# EAGLE design 0129_ultrasound (EAGLE 9.6.2)
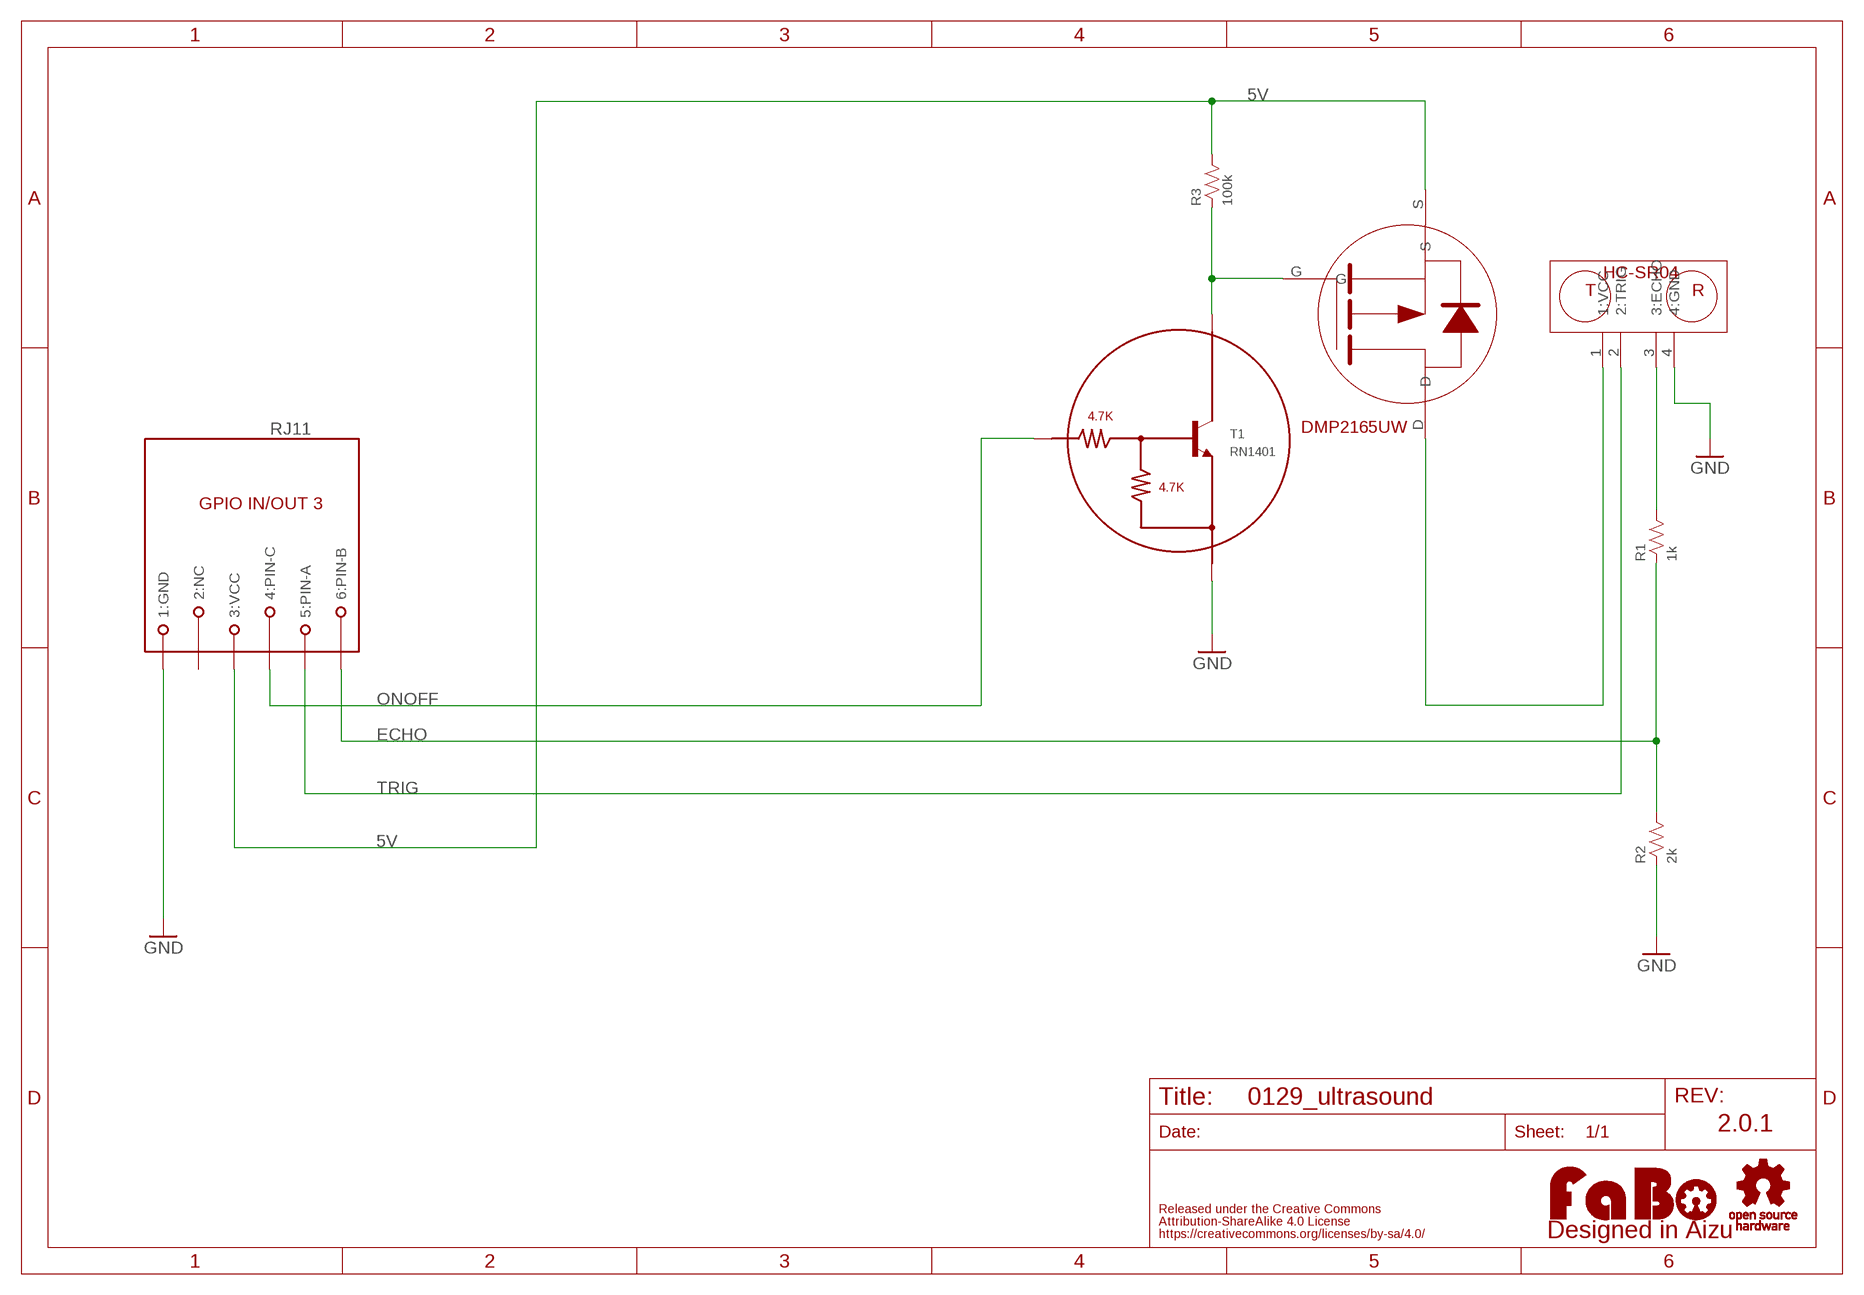
[diagram p0: schematic, sheet 1]

## Parts
LOGO1  LOGO_FABO-M_BOTTOM  [LOGO_FABO_M_BOTTOM]
PFET  DMP2165UW  [DMP2165_SOT323]
R1  1k  RESISTOR-0603-NARROW  [0603-NARROW]
R2  2k  RESISTOR-0603-NARROW  [0603-NARROW]
R3  100k  RESISTOR-0603-NARROW  [0603-NARROW]
RJ11  MODULAR-JACK-6P-RJ11_GPIO3  [7002-6PXC-X]
T1  RN1401  [SC-59]
U$3  LOGO_OSHW-M_BOTTOM  [LOGO_OSHW_M_BOTTOM]
U$5  HC-SR04  [HC-SR04]

## Nets
5V: PFET.S R3.2 RJ11.3(3:VCC)
ECHO: R1.1 R2.2 RJ11.6(6:PIN-B)
GND: R2.1 RJ11.1(1:GND) T1.E U$5.4(4:GND)
N$8: R1.2 U$5.3(3:ECHO)
N$9: PFET.D U$5.1(1:VCC)
ONOFF: RJ11.4(4:PIN-C) T1.B
POWERONOFF: PFET.G R3.1 T1.C
TRIG: RJ11.5(5:PIN-A) U$5.2(2:TRIG)
Unconnected: RJ11.2(2:NC)

## Notes on the sheet
- 2.0.1

## Library data of the parts
LOGO1 = component:LOGO_FABO
PFET = FaBo-Mosfet:DMP2165UW
R1-R3 = FaBo-Resistors:RESISTOR: RESISTOR
RJ11 = FaBo-Connetor:MODULAR-JACK-6P-RJ11_GPIO3
T1 = FaBo-Transistor:RN1401
U$3 = component:LOGO_OSHW
U$5 = FaBo-Sensor:HC-SR04

## Board
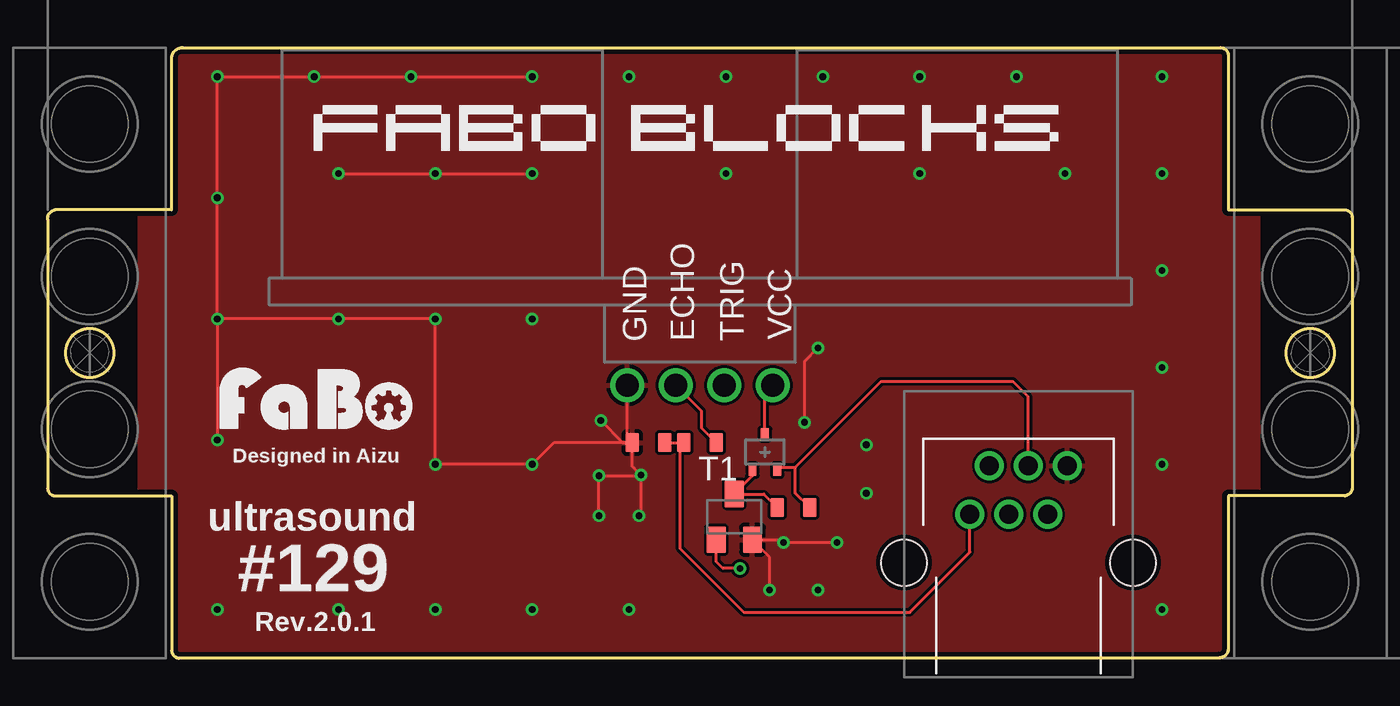
[diagram p1: board, top side]
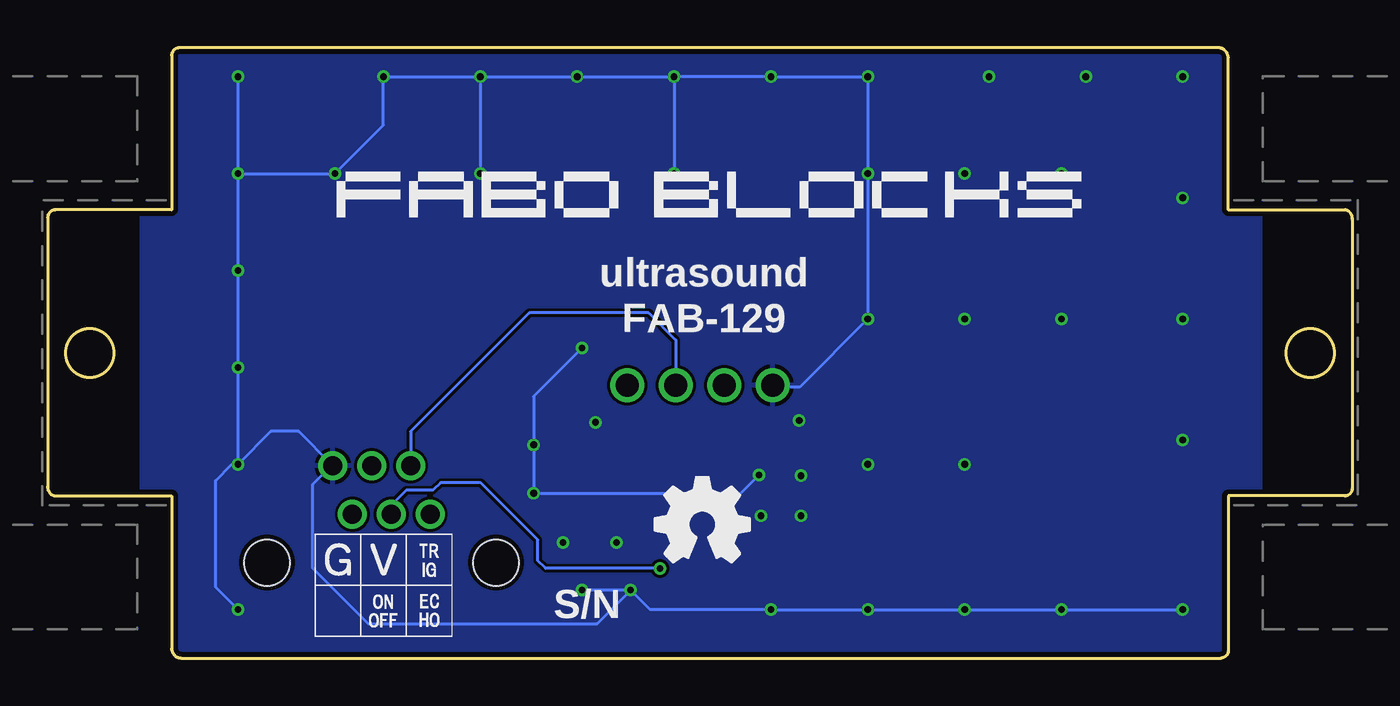
[diagram p2: board, bottom side, seen from below]

Size 68.41 x 32 mm. Coordinates in mm from the lower left corner, seen from the top.
Outline: 7.1,32 61.5,32 arc-90 61.9,31.6 61.9,23.5 68,23.5 arc-90 68.4,23.1 68.4,9 arc-90 68,8.5 61.9,8.5 61.9,0.5 arc-90 61.4,0 6.9,0 arc-90 6.5,0.4 6.5,8.5 0.4,8.5 arc-90 0,8.9 0,23 arc-90 0.4,23.5 6.5,23.5 6.5,31.5 arc-90 7.1,32
Outline: circle at 66.2,16 radius 1.27
Outline: circle at 2.2,16 radius 1.27
Copper layers (1*16): Top 0.035mm / dielectric 1.6mm / Bottom 0.035mm
Design rules "PCBway": minimum track width 6mil, minimum drill 12mil, track to track 6mil, track to pad 6mil, pad to pad 6mil, via to via 6mil, smd to smd 6mil, copper to edge 10mil, drill to drill 10mil, minimum pad ring 10mil, minimum via ring 6mil, stop-mask expansion 2mil, vias tented up to drill 100mil, thermal gap 8mil
tRestrict: area -1.2,7.3 to 4.7,24.4; area 63.6,7.5 to 69.5,24.6
bRestrict: area -1.2,7.3 to 4.7,24.4; area 63.6,7.6 to 69.5,24.7

### Footprints (pad centres in the part's own frame; a part is rotated, then mirrored left to right if it is on the bottom)
DMP2165_SOT323 = smd 0.47 x 0.6: D 0,0.95; G -0.65,-0.95; S 0.65,-0.95
0603-NARROW = smd 0.71 x 1: 1 -0.85,0; 2 0.85,0
7002-6PXC-X = drill 1: 1 2.55,5.08; 2 1.53,2.54; 3 0.51,5.08; 4 -0.51,2.54; 5 -1.53,5.08; 6 -2.55,2.54 | hole 2.4: -6,0; 6,0
SC-59 = smd 1 x 1.4: B -0.95,-1.2; C 0,1.2; E 0.95,-1.2
HC-SR04 = drill 1.2: 1 -3.81,0; 2 -1.27,0; 3 1.27,0; 4 3.81,0

### Placement (x,y rotation side)
LOGO1  14.07,11.61 0 bottom
PFET  37.6,10.8 0 top
R1  34.2,11.3 0 top
R2  31.5,11.3 0 top
R3  39.1,7.9 0 top
RJ11  50.9,5 0 top
T1  36,7.4 0 top
U$2  [4-1BLOCK]  2.2,16 0 top
U$3  34.07,7.01 0 top
U$4  [4-1BLOCK]  66.2,16 180 top
U$5  34.2,14.3 180 top

### Tracks (layer width: path | path; a pad name or v marks a point on that pad's centre or on a via)
5V
  Top 0.152: RJ11.3 51.41,13.69 50.6,14.5 43.7,14.5 39.2,10 | 39.95,8.25 R3.2 39.2,8.65 39.2,10 | PFET.S 38.4,10 39.2,10
ECHO
  Top 0.152: R2.2 R1.1 33.15,11.1 33.15,5.75 36.5,2.4 45.2,2.4 48.35,5.55 RJ11.6
GND  (via drill 0.35)
  Top 0.152: 31,9.7 v31.1,9.6 31.1,7.56 v31,7.46 | 31,9.7 30.65,10.05 R2.1 | R2.1 30.39,11.56 U$5.4 | R2.1 26.54,11.3 v25.4,10.16 v20.32,10.16 v20.32,17.78 v15.24,17.78 v8.89,17.78 | v8.89,17.78 v8.89,11.43 | v8.89,17.78 v8.89,24.13 v8.89,30.48 v13.97,30.48 v19.05,30.48 v25.4,30.48 | v15.24,25.4 v20.32,25.4 v25.4,25.4 | v28.9,7.46 v28.9,9.56 30.86,9.56 31,9.7 | v29,12.46 30.16,11.3 R2.1 | v39.68,12.36 39.68,15.56 v40.38,16.26 | v37.84,3.56 37.84,5.31 T1.E 38.44,6.2 v38.58,6.06 v41.38,6.06
  Bottom 0.152: U$5.4 30.39,14.2 28.98,14.2 v25.4,17.78 v25.4,25.4 v25.4,30.48 v30.48,30.48 v35.56,30.48 | v37.84,3.56 39.6,1.8 51.6,1.8 54.5,4.7 54.5,9.1 53.49,10.12 | v37.84,3.56 v40.38,3.56 | v37.84,3.56 36.82,2.54 v30.48,2.54 v25.4,2.54 v20.32,2.54 v15.24,2.54 v8.89,2.54 | v58.42,2.54 59.6,3.72 59.6,9.3 58.74,10.16 v58.42,10.16 | v58.42,10.16 56.7,11.88 55.25,11.88 53.49,10.12 | v58.42,10.16 v58.42,15.24 v58.42,20.32 v58.42,25.4 | v58.42,25.4 v58.42,30.48 | v58.42,25.4 v53.34,25.4 50.8,27.94 v50.8,30.48 v45.72,30.48 | v45.72,30.48 v45.72,25.4 | v45.72,30.48 v40.64,30.48 v35.56,30.48 | v35.56,30.48 v35.56,25.4 | v40.38,16.26 42.92,13.72 v42.92,11.18 v42.92,8.64 32.06,8.64 v31.1,9.6 | RJ11.1 53.49,10.12
  pour Bottom (rank 6): -12.1,-5.1 96.3,-5.1 96.3,40 -12.1,40
  pour Top (rank 6): -9.2,-2.7 88.3,-2.7 88.3,37.3 -9.2,37.3
N$8
  Top 0.152: R1.2 34.29,12.06 34.29,12.94 U$5.3
N$9
  Top 0.152: PFET.D 37.6,13.89 U$5.1
ONOFF  (via drill 0.35)
  Top 0.152: v36.3,4.7 35.4,4.7 35.05,5.05 T1.B
  Bottom 0.152: v36.3,4.7 42.3,4.7 42.7,5.1 42.7,6.2 45.7,9.2 47.8,9.2 48.2,8.8 49.6,8.8 50.39,8.01 RJ11.4
POWERONOFF
  Top 0.152: PFET.G 36.95,9.55 T1.C 37.55,8.6 R3.1
TRIG
  Bottom 0.152: U$5.2 35.47,16.67 36.9,18.1 43.15,18.1 49.37,11.88 RJ11.5

### Text on the board
tPlace: GND | ECHO | TRIG | VCC | Designed in Aizu | ultrasound | #129 | Rev.2.0.1
bPlace: ultrasound | FAB-129 | S/N
tDocu: HC-SR04 | DMP2165UW | RJ11-06 | #129_ultrasound Rev2.0.1 / 2022/08/03